# EAGLE design Sensor Al_Fatih Multiplekser Baru (EAGLE 7.2.0)
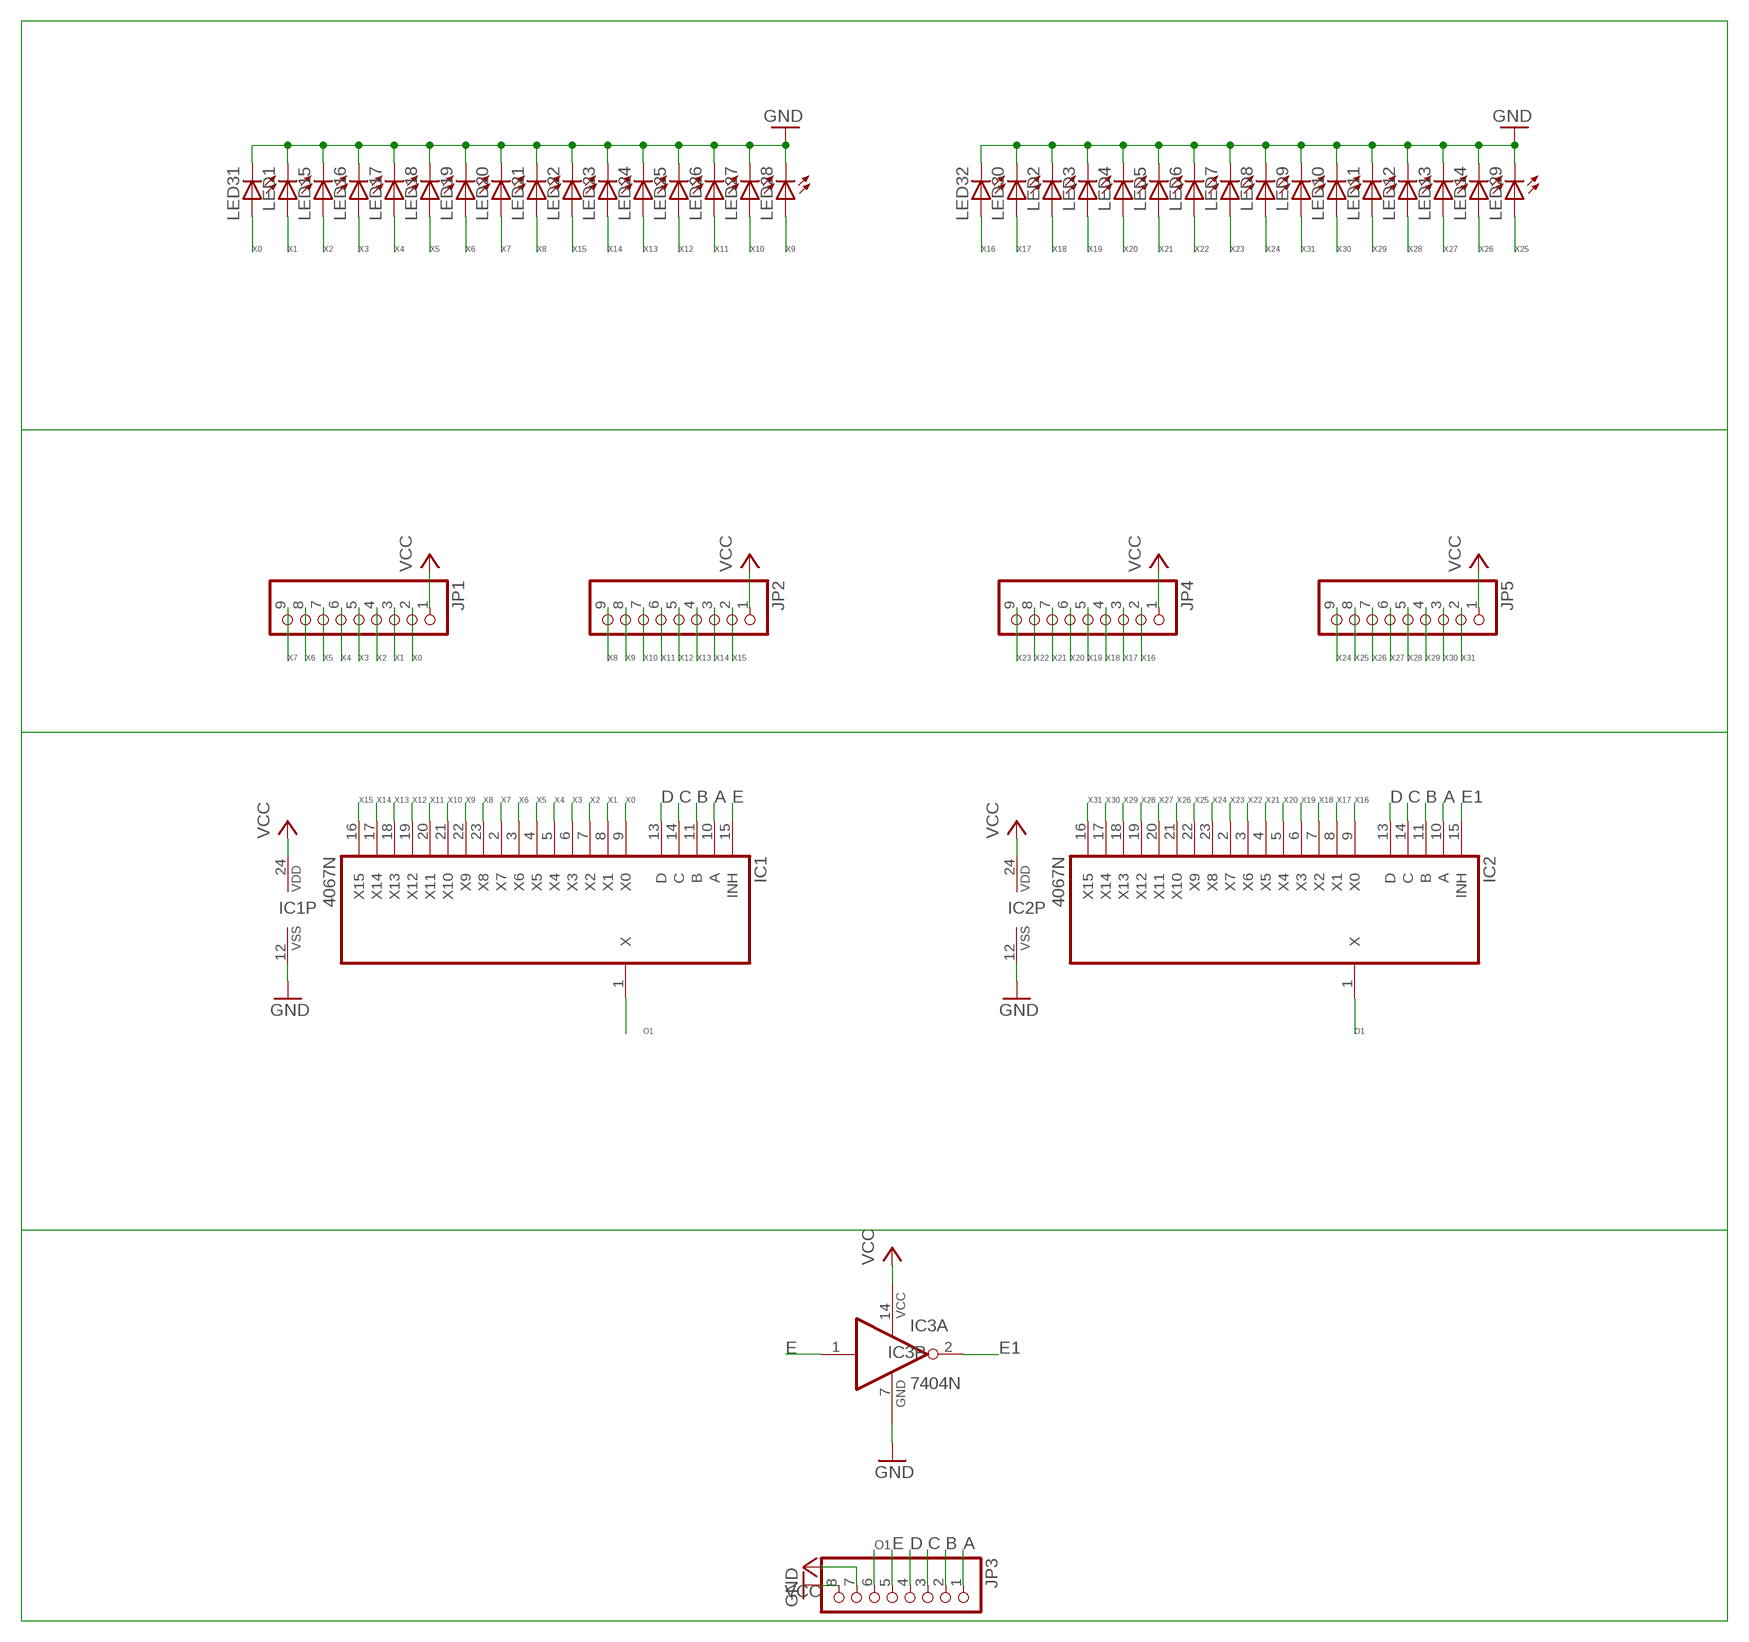
[diagram p0: schematic, sheet 1]

## Parts
IC1  4067N  [DIL24-6]
IC2  4067N  [DIL24-6]
IC3  7404N  [DIL14]
JP1  PINHD-1X9  [1X09]
JP2  PINHD-1X9  [1X09]
JP3  PINHD-1X8  [1X08]
JP4  PINHD-1X9  [1X09]
JP5  PINHD-1X9  [1X09]
LED1  LED3MM  [LED3MM]
LED2  LED3MM  [LED3MM]
LED3  LED3MM  [LED3MM]
LED4  LED3MM  [LED3MM]
LED5  LED3MM  [LED3MM]
LED6  LED3MM  [LED3MM]
LED7  LED3MM  [LED3MM]
LED8  LED3MM  [LED3MM]
LED9  LED3MM  [LED3MM]
LED10  LED3MM  [LED3MM]
LED11  LED3MM  [LED3MM]
LED12  LED3MM  [LED3MM]
LED13  LED3MM  [LED3MM]
LED14  LED3MM  [LED3MM]
LED15  LED3MM  [LED3MM]
LED16  LED3MM  [LED3MM]
LED17  LED3MM  [LED3MM]
LED18  LED3MM  [LED3MM]
LED19  LED3MM  [LED3MM]
LED20  LED3MM  [LED3MM]
LED21  LED3MM  [LED3MM]
LED22  LED3MM  [LED3MM]
LED23  LED3MM  [LED3MM]
LED24  LED3MM  [LED3MM]
LED25  LED3MM  [LED3MM]
LED26  LED3MM  [LED3MM]
LED27  LED3MM  [LED3MM]
LED28  LED3MM  [LED3MM]
LED29  LED3MM  [LED3MM]
LED30  LED3MM  [LED3MM]
LED31  LED3MM  [LED3MM]
LED32  LED3MM  [LED3MM]

## Nets
A: IC1.10(A) IC2.10(A) JP3.1
B: IC1.11(B) IC2.11(B) JP3.2
C: IC1.14(C) IC2.14(C) JP3.3
D: IC1.13(D) IC2.13(D) JP3.4
E: IC1.15(INH) IC3.1(A:I) JP3.5
E1: IC2.15(INH) IC3.2(A:O)
GND: IC1.12(VSS) IC2.12(VSS) IC3.7(P:GND) JP3.8 LED1.K(C) LED2.K(C) LED3.K(C) LED4.K(C) LED5.K(C) LED6.K(C) LED7.K(C) LED8.K(C) LED9.K(C) LED10.K(C) LED11.K(C) LED12.K(C) LED13.K(C) LED14.K(C) LED15.K(C) LED16.K(C) LED17.K(C) LED18.K(C) LED19.K(C) LED20.K(C) LED21.K(C) LED22.K(C) LED23.K(C) LED24.K(C) LED25.K(C) LED26.K(C) LED27.K(C) LED28.K(C) LED29.K(C) LED30.K(C) LED31.K(C) LED32.K(C)
O1: IC1.1(X) IC2.1(X) JP3.6
VCC: IC1.24(VDD) IC2.24(VDD) IC3.14(P:VCC) JP1.1 JP2.1 JP3.7 JP4.1 JP5.1
X0: IC1.9(X0) JP1.2 LED31.A
X1: IC1.8(X1) JP1.3 LED1.A
X2: IC1.7(X2) JP1.4 LED15.A
X3: IC1.6(X3) JP1.5 LED16.A
X4: IC1.5(X4) JP1.6 LED17.A
X5: IC1.4(X5) JP1.7 LED18.A
X6: IC1.3(X6) JP1.8 LED19.A
X7: IC1.2(X7) JP1.9 LED20.A
X8: IC1.23(X8) JP2.9 LED21.A
X9: IC1.22(X9) JP2.8 LED28.A
X10: IC1.21(X10) JP2.7 LED27.A
X11: IC1.20(X11) JP2.6 LED26.A
X12: IC1.19(X12) JP2.5 LED25.A
X13: IC1.18(X13) JP2.4 LED24.A
X14: IC1.17(X14) JP2.3 LED23.A
X15: IC1.16(X15) JP2.2 LED22.A
X16: IC2.9(X0) JP4.2 LED32.A
X17: IC2.8(X1) JP4.3 LED30.A
X18: IC2.7(X2) JP4.4 LED2.A
X19: IC2.6(X3) JP4.5 LED3.A
X20: IC2.5(X4) JP4.6 LED4.A
X21: IC2.4(X5) JP4.7 LED5.A
X22: IC2.3(X6) JP4.8 LED6.A
X23: IC2.2(X7) JP4.9 LED7.A
X24: IC2.23(X8) JP5.9 LED8.A
X25: IC2.22(X9) JP5.8 LED29.A
X26: IC2.21(X10) JP5.7 LED14.A
X27: IC2.20(X11) JP5.6 LED13.A
X28: IC2.19(X12) JP5.5 LED12.A
X29: IC2.18(X13) JP5.4 LED11.A
X30: IC2.17(X14) JP5.3 LED10.A
X31: IC2.16(X15) JP5.2 LED9.A
Unconnected: IC3.3(B:I) IC3.4(B:O) IC3.5(C:I) IC3.6(C:O) IC3.8(D:O) IC3.9(D:I) IC3.10(E:O) IC3.11(E:I) IC3.12(F:O) IC3.13(F:I)

## Library data of the parts
IC1 IC2 = 40xx:4067: 16-channel ANALOG MULTIPLEXER
IC3 = 74xx-us:74*04: Hex INVERTER
JP1 JP2 JP4 JP5 = pinhead:PINHD-1X9: PIN HEADER
JP3 = pinhead:PINHD-1X8: PIN HEADER
LED1-LED32 = led:LED: LED OSRAM: - CHIPLED LG R971, LG N971, LY N971, LG Q971, LY Q971, LO R971, LY R971 LH N974, LH R974 LS Q976, LO Q976, LY Q976 LO Q996 - Hyper CHIPLED LW Q18S LB Q993, LB Q99A, LB R99A - SideLED LS A670, LO A670, LY A670, LG A670, LP A670 LB A673, LV A673, LT A673, LW A673 LH A674 LY A675 LS A676, LA A676, LO A676, LY A676, LW A676 LS A679, LY A679, LG A679 - Hyper Micro SIDELED® LS Y876, LA Y876, LO Y876, LY Y876 LT Y87S - SmartLED LW L88C, LW L88S LB L89C, LB L89S, LG L890 LS L89K, LO L89K, LY L89K LS L896, LA L896, LO L896, LY L896 - TOPLED LS T670, LO T670, LY T670, LG T670, LP T670 LSG T670, LSP T670, LSY T670, LOP T670, LYG T670 LG T671, LOG T671, LSG T671 LB T673, LV T673, LT T673, LW T673 LH T674 LS T676, LA T676, LO T676, LY T676, LB T676, LH T676, LSB T676, LW T676 LB T67C, LV T67C, LT T67C, LS T67K, LO T67K, LY T67K, LW E67C LS E67B, LA E67B, LO E67B, LY E67B, LB E67C, LV E67C, LT E67C LW T67C LS T679, LY T679, LG T679 LS T770, LO T770, LY T770, LG T770, LP T770 LB T773, LV T773, LT T773, LW T773 LH T774 LS E675, LA E675, LY E675, LS T675 LS T776, LA T776, LO T776, LY T776, LB T776 LHGB T686 LT T68C, LB T68C - Hyper Mini TOPLED® LB M676 - Mini TOPLED Santana® LG M470 LS M47K, LO M47K, LY M47K Source: http://www.osram.convergy.de LUXEON: - LUMILED® LXK2-PW12-R00, LXK2-PW12-S00, LXK2-PW14-U00, LXK2-PW14-V00 LXK2-PM12-R00, LXK2-PM12-S00, LXK2-PM14-U00 LXK2-PE12-Q00, LXK2-PE12-R00, LXK2-PE12-S00, LXK2-PE14-T00, LXK2-PE14-U00 LXK2-PB12-K00, LXK2-PB12-L00, LXK2-PB12-M00, LXK2-PB14-N00, LXK2-PB14-P00, LXK2-PB14-Q00 LXK2-PR12-L00, LXK2-PR12-M00, LXK2-PR14-Q00, LXK2-PR14-R00 LXK2-PD12-Q00, LXK2-PD12-R00, LXK2-PD12-S00 LXK2-PH12-R00, LXK2-PH12-S00 LXK2-PL12-P00, LXK2-PL12-Q00, LXK2-PL12-R00 Source: www.luxeon.com KINGBRIGHT: KA-3528ASYC Source: www.kingbright.com

## Board
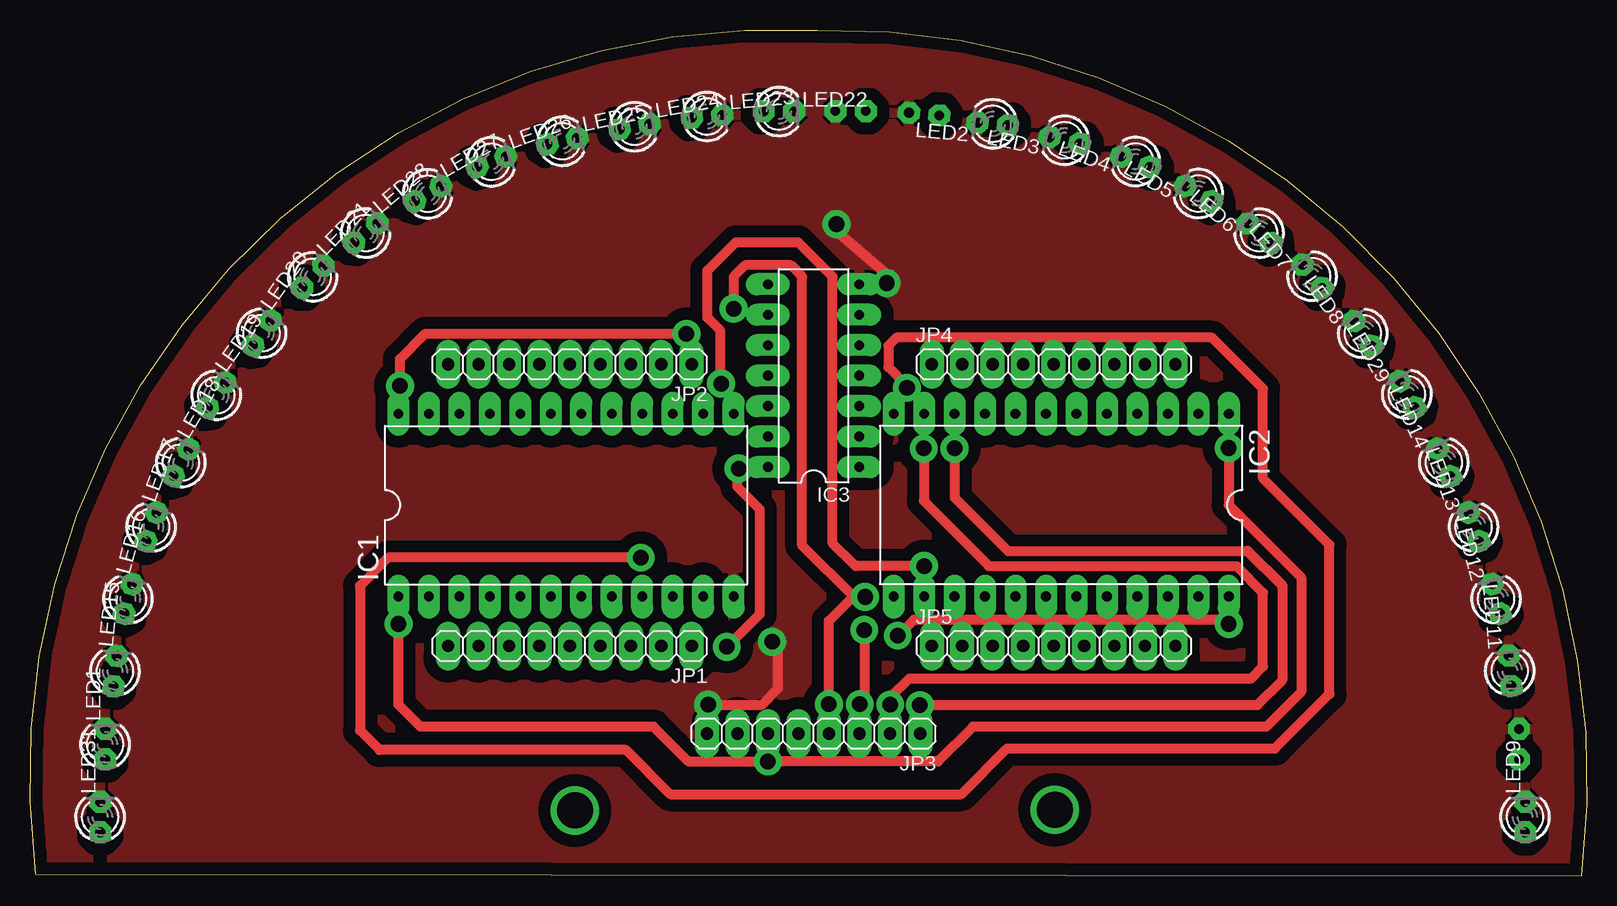
[diagram p1: board, top side]
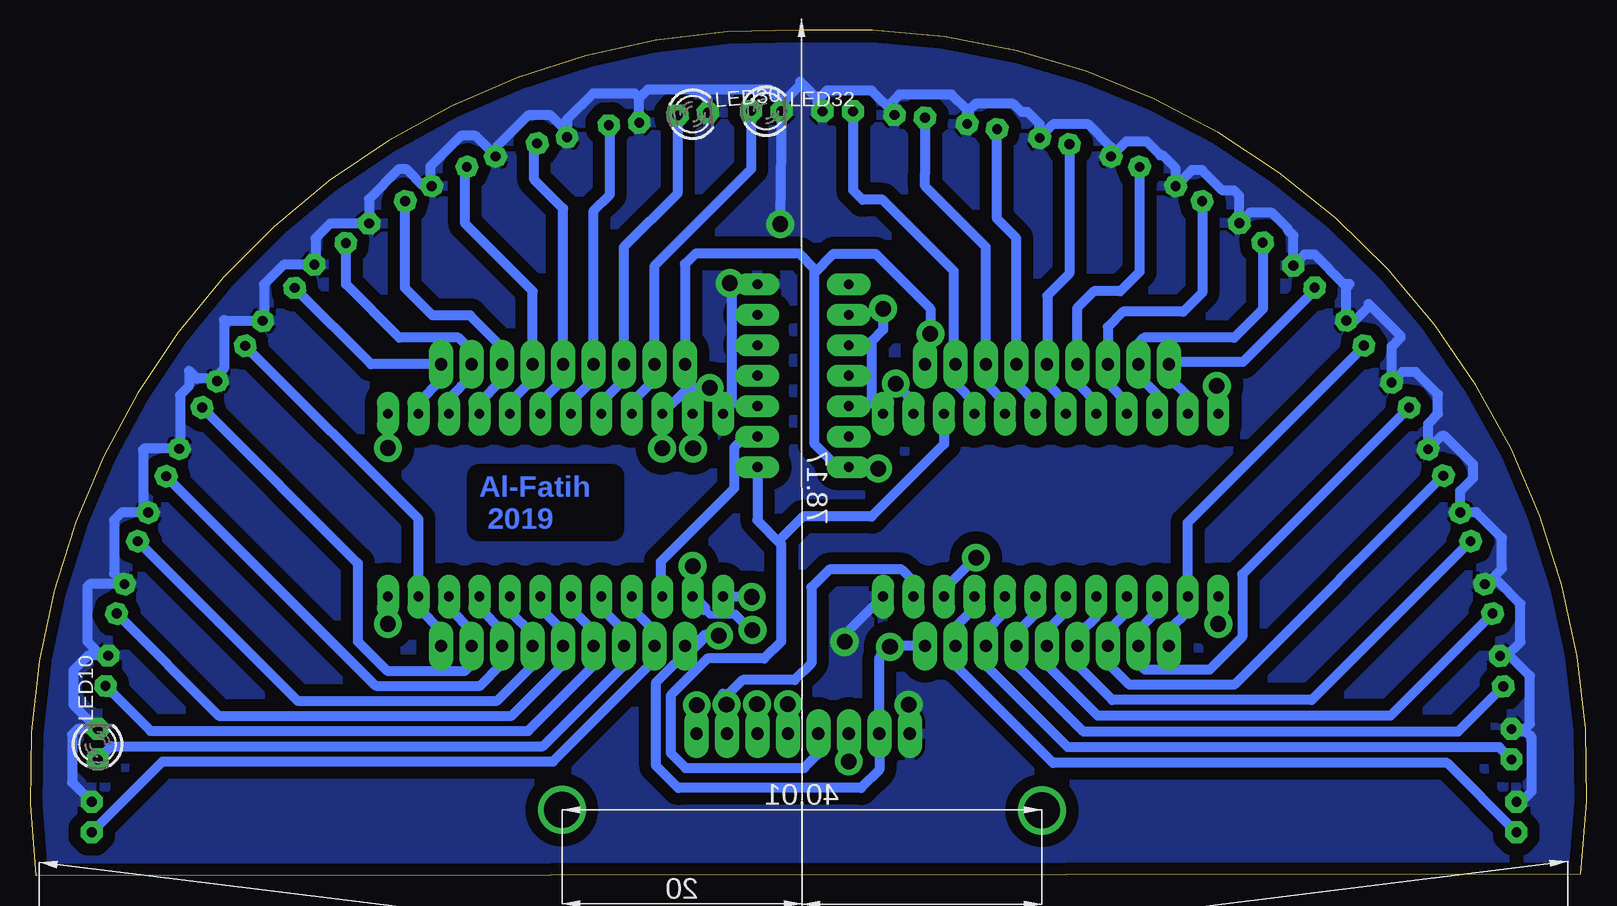
[diagram p2: board, bottom side, seen from below]

Size 129.77 x 70.51 mm. Coordinates in mm from the lower left corner, seen from the top.
Outline: 0.49,0.13 arc-100 65.64,70.48 arc-99 129.3,0 0.49,0.13
Copper layers (1*16): Top 0.035mm / dielectric 1.5mm / Bottom 0.035mm
Design rules "default *": minimum track width 10mil, minimum drill 24mil, track to track 8mil, track to pad 8mil, pad to pad 8mil, via to via 8mil, smd to smd 8mil, copper to edge 40mil, drill to drill 8mil, minimum pad ring 21mil, minimum via ring 21mil, stop-mask expansion 4mil, vias tented up to drill 0mil, thermal gap 10mil

### Footprints (pad centres in the part's own frame; a part is rotated, then mirrored left to right if it is on the bottom)
DIL24-6 = drill 0.813 long: 1 -13.97,-7.62; 2 -11.43,-7.62; 3 -8.89,-7.62; 4 -6.35,-7.62; 5 -3.81,-7.62; 6 -1.27,-7.62; 7 1.27,-7.62; 8 3.81,-7.62; 9 6.35,-7.62; 10 8.89,-7.62; 11 11.43,-7.62; 12 13.97,-7.62; 13 13.97,7.62; 14 11.43,7.62; 15 8.89,7.62; 16 6.35,7.62; 17 3.81,7.62; 18 1.27,7.62; 19 -1.27,7.62; 20 -3.81,7.62; 21 -6.35,7.62; 22 -8.89,7.62; 23 -11.43,7.62; 24 -13.97,7.62
DIL14 = drill 0.813 long: 1 -7.62,-3.81; 2 -5.08,-3.81; 3 -2.54,-3.81; 4 0,-3.81; 5 2.54,-3.81; 6 5.08,-3.81; 7 7.62,-3.81; 8 7.62,3.81; 9 5.08,3.81; 10 2.54,3.81; 11 0,3.81; 12 -2.54,3.81; 13 -5.08,3.81; 14 -7.62,3.81
1X09 = drill 1.016 long: 1 -10.16,0; 2 -7.62,0; 3 -5.08,0; 4 -2.54,0; 5 0,0; 6 2.54,0; 7 5.08,0; 8 7.62,0; 9 10.16,0
1X08 = drill 1.016 long: 1 -8.89,0; 2 -6.35,0; 3 -3.81,0; 4 -1.27,0; 5 1.27,0; 6 3.81,0; 7 6.35,0; 8 8.89,0
LED3MM = drill 0.813 octagon: A -1.27,0; K 1.27,0

### Placement (x,y rotation side)
IC1  44.69,30.89 0 top
IC2  85.96,30.89 180 top
IC3  65.32,41.69 90 top
JP1  45,19.15 180 top
JP2  45,42.64 180 top
JP3  65.32,11.84 180 top
JP4  85.33,42.64 0 top
JP5  85.33,19.15 0 top
LED1  6.27,10.95 90 top
LED2  80.25,62.67 175 top
LED3  86.25,61.31 168 top
LED4  92.15,59.53 160 top
LED5  97.39,56.86 150 top
LED6  102.47,53.56 140 top
LED7  106.89,49.97 130 top
LED8  111.11,45.21 125 top
LED9  124.63,4.89 90 top
LED10  124.13,10.95 90 bottom
LED11  123.36,17.08 95 top
LED12  122.22,23.08 105 top
LED13  120.35,29.08 110 top
LED14  117.87,34.45 115 top
LED15  7.1,17.05 84 top
LED16  8.17,23.08 75 top
LED17  10.11,29.08 70 top
LED18  12.59,34.45 60 top
LED19  15.54,40.07 55 top
LED20  19.32,45.24 55 top
LED21  23.57,49.94 46 top
LED22  62.44,63.72 0 top
LED23  56.43,63.31 5 top
LED24  50.4,62.45 10 top
LED25  44.37,61.25 12 top
LED26  38.46,59.53 20 top
LED27  33.16,56.86 30 top
LED28  27.99,53.59 40 top
LED29  114.79,40.13 120 top
LED30  74.53,63.5 5 bottom
LED31  5.86,4.89 90 top
LED32  68.4,63.75 0 bottom

### Tracks (layer width: path | path; a pad name or v marks a point on that pad's centre or on a via)
A  (via drill 1.3)
  Top 0.813: 104.38,24.22 101.52,27.08 81.52,27.08 77.07,31.53 v77.07,35.62 | 104.38,24.22 104.38,16.29 102.31,14.22 v74.18,14.22 | v50.91,26.51 29.86,26.51 27.51,24.16 27.51,12.1 29.13,10.48 49.67,10.48 53.36,6.79 77.64,6.79 81.45,10.6 103.77,10.6 108.31,15.14 108.31,27.59 102.79,33.12 102.79,40.61 98.54,44.86 72.21,44.86 71.55,44.2 71.55,42.39 73.1,40.83 v73.1,40.67 | 104.38,24.22 104.31,24.22 101.49,27.05 81.55,27.05
  Bottom 0.813: v77.07,35.62 IC2.10 74.91,40.67 v73.1,40.67 | JP3.1 74.21,13.21 v74.18,14.22 | IC1.10 53.58,23.84 v50.91,26.51
B  (via drill 1.3)
  Top 0.813: v74.5,35.62 74.5,31.24 79.93,25.81 100.57,25.81 102.79,23.59 102.79,17.43 101.81,16.45 73.29,16.45 71.74,14.89 v71.71,14.26
  Bottom 0.813: IC1.11 56.12,24.54 57.1,25.53 63.13,25.53 64.63,24.03 64.63,17.72 66.02,16.32 70.37,16.32 71.53,15.16 72.01,15.16 71.98,14.53 v71.71,14.26 | IC2.11 74.53,36.04 | 74.53,36.04 74.47,35.97 | 74.53,36.04 74.53,35.59 v74.5,35.62 | JP3.2 71.68,14.13 v71.71,14.26 | 71.64,14.29 v71.71,14.26
C  (via drill 1.3)
  Top 0.813: v74.53,25.81 68.82,25.81 66.91,27.72 66.91,49.94 64.06,52.8 58.82,52.8 56.47,50.45 56.47,46.51 57.55,45.43 57.55,41.08 v57.61,41.02 | 69.13,14.48 v69.17,14.29 69.55,14.67 v69.55,20.48
  Bottom 0.61: 70.98,21.75 73.1,21.75 73.58,22.22
  Bottom 0.813: v74.53,25.81 IC2.14 74.44,23.27 | v69.17,14.29 69.17,11.87 JP3.3 | v69.55,20.48 69.71,20.48 70.98,21.75 | IC1.14 56.12,39.53 v57.61,41.02
  Bottom 1.016: 73.58,22.22 73.58,22.32 IC2.14
D  (via drill 1.3)
  Top 0.813: v66.59,14.29 66.59,21.24 68.63,23.27 | 68.63,23.27 64.37,27.53 64.37,49.94 63.42,50.89 59.61,50.89 58.66,49.94 v58.66,47.28 | 68.63,23.27 69.58,23.27 v69.61,23.24
  Bottom 0.813: JP3.4 v66.59,14.29 | v69.61,23.24 71.96,23.24 IC2.13 | v58.66,47.28 58.66,45.53 59.64,44.54 59.64,39.5 IC1.13
E
  Bottom 0.813: IC1.15 53.58,35.97 59.61,29.94 65.32,29.94 67.23,28.04 67.23,27.72 | IC3.1 69.13,29.62 67.23,27.72 | 67.23,27.72 67.17,27.65 67.17,19.49 68.56,18.1 73.29,18.1 76.37,15.02 76.37,10.22 75.14,8.98 65.23,8.98 64.12,10.1 64.12,11.78 JP3.5
E1
  Bottom 0.813: IC3.2 70.15,36.61 71.07,35.69 71.07,32.29 77.2,26.16 77.2,23.4 IC2.15
GND  (via drill 1.3)
  Top 0.813: v71.42,49.4 71.29,50.23 67.23,53.75 v67.23,54.32 | v56.53,14.26 61.01,14.26 62.37,15.62 62.37,18.99 v61.86,19.49
  Bottom 0.813: LED31.K 5.44,6.16 4.59,7.02 4.59,11.56 5.03,12 6.05,12 LED1.K 5.16,12.22 4.75,12.64 4.75,16.67 6.37,18.29 7.2,18.29 LED15.K 6.69,18.31 5.54,19.46 5.54,22.67 7.38,24.51 8.3,24.51 LED16.K 8.35,24.31 7.06,25.59 7.06,28.16 9.19,30.29 10.53,30.29 LED17.K 10.55,32.08 9.48,33.15 9.48,34.29 11.83,36.64 12.13,36.64 LED18.K 13.22,37.69 12.4,38.51 12.4,40.13 14.27,42 15.37,42 LED19.K 16.27,44.13 15.54,44.86 15.54,45.02 18.18,47.66 18.18,47.43 19.83,45.78 19.83,46.06 LED20.K 20.05,49.06 19.76,49.34 20.24,49.34 22.68,51.78 23.53,51.78 LED21.K 24.46,53.4 24.94,53.88 24.94,53.97 26.24,55.28 28.09,55.28 LED28.K 28.96,56.69 29.38,57.12 30.37,57.12 32.08,58.83 32.93,58.83 LED27.K 34.26,58.98 35.35,60.07 35.54,60.07 36.69,61.21 38.41,61.21 LED26.K 39.66,60.76 41.54,62.64 44.48,62.64 LED25.K 45.61,62.68 46.59,63.66 47.1,63.66 47.8,64.36 50.97,64.36 51.48,63.85 51.48,62.75 LED24.K 51.67,63.84 52.94,65.12 57.29,65.12 57.9,64.52 57.9,63.5 LED23.K 57.7,63.56 59.61,65.47 63.36,65.47 64.15,64.67 64.15,64.17 LED22.K 63.71,64.36 65.58,66.23 65.58,65.91 67.64,63.85 | 74.12,65.53 68.09,65.53 67.13,64.58 LED32.K 67.23,54.77 v67.23,54.32 | 74.12,65.53 78.29,65.53 78.98,64.84 | LED2.K 78.98,64.84 | 78.98,64.84 79.36,65.21 82.85,65.21 85.01,63.06 LED3.K 85.01,62.04 86.38,63.4 88.25,63.4 90.82,60.83 90.82,60.11 LED4.K 90.96,60.02 92.63,61.69 93.84,61.69 96.41,59.12 96.41,57.61 LED5.K 96.98,57.5 98.38,58.9 99.04,58.9 101.52,56.42 101.52,54.4 LED6.K 104.74,54.38 105.96,53.15 105.96,51.05 LED7.K 108.61,50.95 110.25,49.31 110.25,46.38 LED8.K 113.51,46.25 113.58,46.32 113.58,42.29 114.7,41.18 114.7,41.43 115.84,41.43 116.51,42.1 116.51,40.83 117.27,40.07 117.27,35.67 LED14.K 120.28,35.6 120.35,35.53 120.35,30.71 LED13.K 122.14,30.28 122.76,29.65 122.76,25.18 LED12.K 124.77,24.31 124.98,24.1 124.98,19.53 123.78,18.32 123.28,18.32 LED11.K 124.92,18.35 126.16,17.11 126.16,14.26 LED10.K 125.81,12.22 126.25,11.78 126.25,7.78 LED9.K
  Bottom 0.813: LED30.K 73.26,64.67 74.12,65.53 | IC2.12 71.99,38.61 71.23,39.37 71.23,48.93 v71.42,49.4 | JP3.8 56.43,14.16 v56.53,14.26 | v61.86,19.49 61.86,20.07 IC1.12
  pour Bottom (isolate 1.016): 128.89,1.17 128.98,1.17 128.76,8 arc90 65.93,69.37 61.55,69.37 arc90 1.19,7.87 1.6,1.21
  pour Top (isolate 1.016): 128.89,1.11 128.98,1.11 128.76,7.94 arc90 65.93,69.31 61.55,69.31 arc90 1.19,7.81 1.6,1.14
N$4  (via drill 3)
  other vias: 45.42,5.43
N$6  (via drill 3)
  other vias: 85.42,5.49
O1  (via drill 1.3)
  Top 0.813: v99.93,35.65 99.93,30.89 105.96,24.86 105.96,15.33 103.04,12.41 78.6,12.41 75.71,9.52 v61.51,9.52 61.48,9.49 54.91,9.49 51.99,12.41 32.56,12.41 30.72,14.26 v30.72,20.99
  Bottom 0.813: IC1.1 v30.72,20.99 | IC2.1 v99.93,35.65 | v61.51,9.52 JP3.6
VCC  (via drill 1.3)
  Top 0.813: v99.93,20.99 99.81,21.34 73.68,21.34 v72.34,20 | v30.84,40.83 30.84,43.08 32.94,45.18 33.48,45.18 36.05,45.18 v54.72,45.18 | v59.07,33.94 58.98,33.85 58.98,32.42 60.85,30.54 60.85,21.81 58.12,19.08 v58.09,19.08
  Bottom 0.813: 62.47,34.07 64.37,35.97 64.37,50.26 | 64.37,50.26 62.79,51.85 59.29,51.85 54.72,47.28 v54.72,45.18 54.72,43.91 55.23,43.4 55.23,42.7 JP2.1 | 64.37,50.26 64.37,50.58 65.64,51.85 74.31,51.85 75.17,50.99 JP4.1 | v99.93,20.99 IC2.24 | JP5.1 75.2,19.11 75.2,18.51 77.58,16.13 77.58,9.14 75.74,7.3 60.5,7.3 58.98,8.83 JP3.7 58.94,11.87 58.94,18.22 v58.09,19.08 58.02,19.15 JP1.1 | IC1.24 30.72,40.45 v30.84,40.83 | v59.07,33.94 61.39,33.94 IC3.14
  Bottom 1.016: IC3.14 62.47,34.07 | JP5.1 74.34,19.15 73.48,20 v72.34,20
X0
  Bottom 0.813: IC1.9 51.04,22.32 52.62,20.73 JP1.2 52.62,17.53 44.5,9.4 11.64,9.4 LED31.A
X1
  Bottom 0.813: IC1.8 48.5,21.97 50.09,20.38 JP1.3 50.09,17.53 43.26,10.7 7.29,10.7 LED1.A
X2
  Bottom 0.813: IC1.7 45.96,21.81 47.54,20.22 JP1.4 47.54,17.59 41.96,12 10.75,12 LED15.A
X3
  Bottom 0.813: IC1.6 43.42,22.03 45.07,20.38 45.07,19.21 JP1.5 45,17.59 40.75,13.33 16.37,13.33 LED16.A
X4
  Bottom 0.813: IC1.5 40.88,21.59 42.24,20.22 42.24,19.37 JP1.6 42.46,17.56 39.54,14.64 22.93,14.64 LED17.A
X5
  Bottom 0.813: IC1.4 38.34,21.97 39.99,20.32 39.99,19.21 JP1.7 39.92,17.72 38.12,15.91 29.4,15.91 LED18.A
X6
  Bottom 0.813: IC1.3 35.8,22.07 37.42,20.45 37.42,19.18 JP1.8 37.35,19.11 37.35,17.72 36.81,17.18 31.45,17.18 28.72,19.91 28.72,25.12 LED19.A
X7
  Bottom 0.813: 34.72,19.02 JP1.9 34.81,19.18 34.81,20.48 33.26,22.03 IC1.2 33.26,29.43 18.59,44.1 LED20.A
X8
  Bottom 0.813: IC1.23 33.26,39.97 34.81,41.53 34.81,42.61 JP2.9 34.65,42.83 28.65,42.83 22.69,48.79 LED21.A
X9
  Bottom 0.813: IC1.22 35.8,40.1 37.42,41.72 37.42,42.61 JP2.8 37.35,42.67 37.35,44.42 36.91,44.86 29.38,44.86 27.01,47.23 LED28.A
X10
  Bottom 0.813: IC1.21 38.34,39.47 39.92,41.05 JP2.7 39.92,45.75 38.66,47.02 33.64,47.02 32.06,48.6 LED27.A
X11
  Bottom 0.813: IC1.20 40.88,39.47 42.46,41.05 JP2.6 42.5,42.67 42.5,47.31 41.07,48.74 38.88,48.74 37.27,50.34 LED26.A
X12
  Bottom 0.813: IC1.19 43.42,39.47 45,41.05 JP2.5 44.97,42.67 44.97,48.36 43.13,50.2 LED25.A
X13
  Bottom 0.813: IC1.18 45.96,39.47 47.54,41.05 JP2.4 47.54,53.15 49.16,54.77 49.16,62.22 LED24.A
X14
  Bottom 0.813: IC1.17 48.5,39.47 50.09,41.05 JP2.3 50.09,52.42 55.17,57.5 55.17,58.58 LED23.A
X15
  Bottom 0.813: IC1.16 51.04,39.47 52.62,41.05 JP2.2 52.75,42.77 52.75,50.42 58.69,56.36 60.37,56.36 61.13,57.12 61.13,59.53 61.17,59.56 | LED22.A 61.17,59.56 | 61.17,59.56 61.17,59.05
X16
  Bottom 0.813: IC2.9 79.61,39.47 77.71,41.37 JP4.2 77.71,50.86 69.64,58.93 69.64,63.72 LED32.A
X17
  Bottom 0.813: IC2.8 82.15,39.47 80.25,41.37 JP4.3 80.28,42.67 80.28,52.39 75.8,56.86 LED30.A
X18
  Bottom 0.813: IC2.7 84.69,39.47 82.79,41.37 JP4.4 82.79,55.44 81.42,56.8 81.42,62.47 LED2.A
X19
  Bottom 0.813: IC2.6 87.23,39.47 85.33,41.37 JP4.5 85.33,55.63 87.74,58.04 87.74,60.79 LED3.A
X20
  Bottom 0.813: IC2.5 89.77,39.47 87.87,41.37 JP4.6 87.87,48.74 93.49,54.36 93.49,58.96 LED4.A
X21
  Bottom 0.813: IC2.4 92.31,39.47 90.41,41.37 JP4.7 90.41,44.04 93.07,46.7 96.22,46.7 98.5,48.99 98.5,56.22 LED5.A
X22
  Bottom 0.813: IC2.3 94.85,39.78 92.95,41.69 JP4.8 92.95,43.75 94.06,44.86 98.98,44.86 103.43,49.31 103.43,52.73 LED6.A | 103.46,52.73 LED6.A | 103.36,52.66 LED6.A
X23
  Bottom 0.813: IC2.2 97.39,39.47 95.49,41.37 JP4.9 101.34,42.64 LED7.A 107.77,48.93
X24
  Bottom 0.813: JP5.9 95.49,20.41 97.39,22.32 IC2.23 97.39,29.73 LED8.A
X25
  Bottom 0.813: IC2.22 94.85,22.32 92.95,20.41 JP5.8 92.92,19.11 92.92,17.65 93.49,17.08 100,17.08 102.44,19.53 102.44,26.05 LED29.A
X26
  Bottom 0.813: IC2.21 92.31,22.32 90.41,20.41 JP5.7 90.44,19.11 90.44,17.65 92.25,15.84 100.95,15.84 LED14.A
X27
  Bottom 0.813: IC2.20 89.77,22.03 87.93,20.19 87.93,19.21 JP5.6 87.84,19.11 87.84,17.59 90.85,14.57 107.47,14.57 LED13.A
X28
  Bottom 0.813: IC2.19 87.23,22.32 85.33,20.41 JP5.5 85.36,19.11 85.36,17.59 89.61,13.33 114.03,13.33 LED12.A
X29
  Bottom 0.813: IC2.18 84.69,22.32 82.79,20.41 JP5.4 82.79,17.53 88.25,12.06 119.72,12.06 LED11.A
X30
  Bottom 0.813: IC2.17 82.15,22.32 80.25,20.41 JP5.3 80.22,19.11 80.22,17.59 87.01,10.79 123.01,10.79 LED10.A
X31
  Bottom 0.813: IC2.16 79.61,22.32 77.71,20.41 JP5.2 | 77.64,19.08 JP5.2 | JP5.2 77.74,19.11 77.74,17.94 86.15,9.52 118.73,9.52 LED9.A

### Text on the board
Bottom: Al-Fatih / 2019